# Altium schematic sheet MotorDriverDRV8313_1.SchDoc
size A4
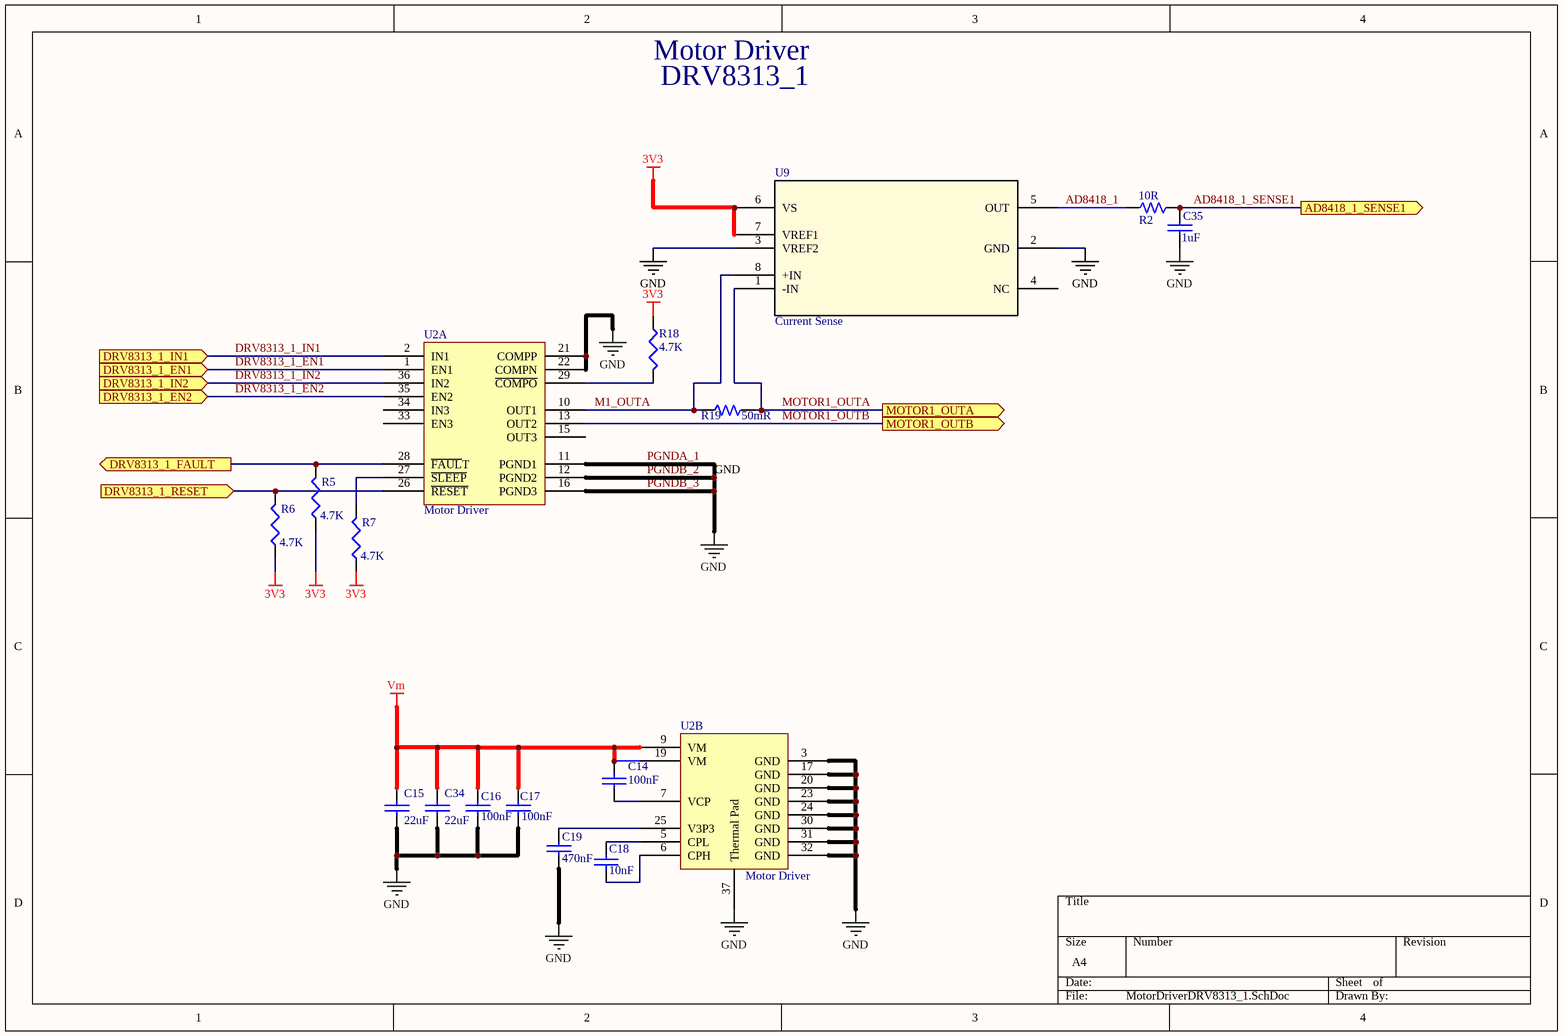
[diagram p0: MotorDriverDRV8313_1.SchDoc]

## Parts
C14  value 100nF  [CAP0402]  (hidden comment: Capacitor)
C15  value 22uF  [CAP0805]  (hidden comment: Capacitor)
C16  value 100nF  [CAP0402]  (hidden comment: Capacitor)
C17  value 100nF  [CAP0402]  (hidden comment: Capacitor)
C18  value 10nF  [CAP0402]  (hidden comment: Capacitor)
C19  value 470nF  [CAP0402]  (hidden comment: Capacitor)
C34  value 22uF  [CAP0805]  (hidden comment: Capacitor)
C35  value 1uF  [CAP0402]  (hidden comment: Capacitor)
R2  Resistance: 10R  [RES0402]  (hidden comment: Resistor)
R5  value 4.7K  [RES0402]  (hidden comment: Res)
R6  value 4.7K  [RES0402]  (hidden comment: Res)
R7  value 4.7K  [RES0402]  (hidden comment: Res)
R18  value 4.7K  [RES0402]  (hidden comment: Res)
R19  Resistance: 50mR  [RES0805]  (hidden comment: Resistor)
U2  Motor Driver  [DRV8313RHHR]  (parts A,B of 2)
U9  Current Sense  [AD8418BRMZ]

## Ports
AD8418_1_SENSE1 (out), DRV8313_1_EN1 (in), DRV8313_1_EN2 (in), DRV8313_1_FAULT (out), DRV8313_1_IN1 (in), DRV8313_1_IN2 (in), DRV8313_1_RESET (in), MOTOR1_OUTA (out), MOTOR1_OUTB (out)

## Nets
3V3: R5.1 R6.1 R7.1 R18.1 U9.6(VS) U9.7(VREF1)
GND: C15.2 C16.2 C17.2 C19.2 C34.2 C35.2 U2.3(GND) U2.11(PGND1) U2.12(PGND2) U2.16(PGND3) U2.17(GND) U2.20(GND) U2.21(COMPP) U2.22(COMPN) U2.23(GND) U2.24(GND) U2.30(GND) U2.31(GND) U2.32(GND) U2.37(Thermal_Pad) U9.2(GND) U9.3(VREF2)  [also labelled PGNDA_1, PGNDB_2, PGNDB_3]
Vm: C14.1 C15.1 C16.1 C17.1 C34.1 U2.9(VM) U2.19(VM)
AD8418_1: R2.1 U9.5(OUT)
AD8418_1_SENSE1: C35.1 R2.2 ; port AD8418_1_SENSE1
DRV8313_1_EN1: U2.1(EN1) ; port DRV8313_1_EN1
DRV8313_1_EN2: U2.35(EN2) ; port DRV8313_1_EN2
DRV8313_1_FAULT: R5.2 U2.28(~{FAUL}T) ; port DRV8313_1_FAULT
DRV8313_1_IN1: U2.2(IN1) ; port DRV8313_1_IN1
DRV8313_1_IN2: U2.36(IN2) ; port DRV8313_1_IN2
DRV8313_1_RESET: R6.2 U2.26(~{RESET}) ; port DRV8313_1_RESET
M1_OUTA: R19.1 U2.10(OUT1) U9.8(+IN)
MOTOR1_OUTA: R19.2 U9.1(-IN) ; port MOTOR1_OUTA
MOTOR1_OUTB: U2.13(OUT2) ; port MOTOR1_OUTB
NetC14_2: C14.2 U2.7(VCP)
NetC18_1: C18.1 U2.5(CPL)
NetC18_2: C18.2 U2.6(CPH)
NetC19_1: C19.1 U2.25(V3P3)
NetR7_2: R7.2 U2.27(~{SLEEP})
NetR18_2: R18.2 U2.29(~{COMPO})

Not connected (* = marked no-connect by the designer): U2 15(OUT3) 33(EN3) 34(IN3); U9 4(NC)

## Notes on the sheet
- Motor Driver
- DRV8313_1

## Library data of the parts
C14 C16 C17 = Capacitor: Manufacturer: TDK Corporation; Manufacturer Part Number: CGA2B3X7R1V104K050BB; Tolerance: 10%; Voltage: 35V; Temperature Coefficient: X7R; Supplier: Digi-Key; Supplier Part Number: 445-6901-1-ND; Footprint: 0201 (0603 Metric); Component Type: Capacitor Ceramic; Price: 0.21
C15 C34 = Capacitor: Manufacturer: TDK Corporation; Manufacturer Part Number: C2012JB1V226M125AC; Tolerance: 20%; Voltage: 35V; Supplier: Digikey; Supplier Part Number: 445-11527-1-ND; Footprint: 0805; Component Type: Capacitor Ceramic; Price: 1.49
C18 = Capacitor: Manufacturer: TDK Corporation; Manufacturer Part Number: C1005X7R1V103K050BB; Tolerance: 10%; Voltage: 35V; Temperature Coefficient: X7R; Supplier: Digi-Key; Supplier Part Number: 445-7338-1-ND; Footprint: 0201 (0603 Metric); Component Type: Capacitor Ceramic; Price: 0.14
C19 = Capacitor: Manufacturer: Murata Electronics North America; Manufacturer Part Number: GRM155R61A474KE15D; Tolerance: 10%; Voltage: 10V; Temperature Coefficient: X5R; Supplier: Digi-Key; Supplier Part Number: 490-3264-1-ND; Footprint: 0201 (0603 Metric); Component Type: Capacitor Ceramic; Price: 0.140
C35 = Capacitor: Manufacturer: TDK Corporation; Manufacturer Part Number: C1005X5R1V105K050BC; Tolerance: 10%; Voltage: 35V; Temperature Coefficient: X5R; Supplier: Digikey; Supplier Part Number: 445-9073-1-ND; Footprint: 0402 (1005 Metric); Component Type: Capacitor Ceramic
R2 = Resistor: Manufacturer 1: Panasonic; Manufacturer Part Number 1: ERJ-2RKF10R0X; Voltage Rating (DC): 50V; Max Power Dissipation: 100mW; Tolerance: 1%; Temperature Coefficient: 100ppm/°C; Supplier 1: Digi-Key; Supplier Part Number 1: P10.0LCT-ND; Stock 1: 6121248; Pricing 1: 1=0,10000, 10=0,04800, 100=0,01960, 1000=0,00882, 2500=0,00766, 5000=0,00633 (USD); RoHS: Yes; Mount: Surface Mount; Case/Package: 0402; Number of Pins: 2; Case Code (Imperial): 0402; Case Code (Metric): 1005; Contact Plating: Tin; Min Operating Temperature: -55°C; Max Operating Temperature: 155°C; Features: Automotive AEC-Q200; Power Rating: 100mW; Termination: SMD/SMT; Composition: Thick Film; Voltage Rating: 50V; Number of Terminations: 2; Packaging: Tape and Reel; Military Standard: Not; Package Quantity: 1; Length: 1mm; Height: 0.35mm; Depth: 0.5mm; Width: 0.5mm; Radiation Hardening: No; Lead Free: Lead Free; REACH SVHC: No SVHC; ComponentLink1URL: https://datasheet.ciiva.com/11821/0900766b80f80784-11821168.pdf?src-supplier=RSComponents; ComponentLink1Description: https://datasheet.ciiva.com/11821/0900766b80f80784-11821168.pdf?src-supplier=RSComponents; ComponentLink2URL: https://datasheet.ciiva.com/7802/aoa0000ce2-7802405.pdf?src-supplier=Element14; ComponentLink2Description: https://datasheet.ciiva.com/7802/aoa0000ce2-7802405.pdf?src-supplier=Element14; ComponentLink3URL: https://datasheet.ciiva.com/43467/1678782-43467127.pdf?src-supplier=Farnell; ComponentLink3Description: https://datasheet.ciiva.com/43467/1678782-43467127.pdf?src-supplier=Farnell; ComponentLink4URL: https://datasheet.ciiva.com/22668/1678782-22668302.pdf?src-supplier=Element14; ComponentLink4Description: https://datasheet.ciiva.com/22668/1678782-22668302.pdf?src-supplier=Element14; ComponentLink5URL: https://datasheet.ciiva.com/16773/70260748-16773366.pdf?src-supplier=Allied+Electronics; ComponentLink5Description: https://datasheet.ciiva.com/16773/70260748-16773366.pdf?src-supplier=Allied+Electronics; ComponentLink6URL: https://datasheet.ciiva.com/9194/aoa0000ce2-9194120.pdf?src-supplier=Avnet; ComponentLink6Description: https://datasheet.ciiva.com/9194/aoa0000ce2-9194120.pdf?src-supplier=Avnet; ComponentLink7URL: https://datasheet.ciiva.com/30218/aoa0000ce2-30218536.pdf?src-supplier=Onlinecomponents.com; ComponentLink7Description: https://datasheet.ciiva.com/30218/aoa0000ce2-30218536.pdf?src-supplier=Onlinecomponents.com; ComponentLink8URL: https://datasheet.ciiva.com/17212/aoa0000ce2-17212057.pdf?src-supplier=Avnet+Europe; ComponentLink8Description: https://datasheet.ciiva.com/17212/aoa0000ce2-17212057.pdf?src-supplier=Avnet+Europe; ComponentLink9URL: https://datasheet.ciiva.com/24071/aoa0000ce2-24071514.pdf?src-supplier=Mouser; ComponentLink9Description: https://datasheet.ciiva.com/24071/aoa0000ce2-24071514.pdf?src-supplier=Mouser; ComponentLink10URL: https://datasheet.ciiva.com/27055/1987054-27055644.pdf?src-supplier=Jameco; ComponentLink10Description: https://datasheet.ciiva.com/27055/1987054-27055644.pdf?src-supplier=Jameco; ComponentLink11URL: https://datasheet.ciiva.com/6082/aoa0000ce2-6082046.pdf?src-supplier=Farnell; ComponentLink11Description: https://datasheet.ciiva.com/6082/aoa0000ce2-6082046.pdf?src-supplier=Farnell
R5-R7 R18 = Resistor: Manufacturer: Yageo; Manufacturer Part Number: RC0402JR-074K7L; Power Rating: 0.063W; Tolerance: 5%; Component Type: Resistor; Price: 0.14; Supplier: Digikey; Supplier Part Number: 311-4.7KJRCT-ND; Footprint: 0402
R19 = Resistor: Manufacturer 1: Bourns; Manufacturer Part Number 1: CRM0805-FW-R050ELF; Power Rating: 250mW; Tolerance: 1%; Voltage Rating: 477mV; Temperature Coefficient: 200ppm/°C; Supplier 1: Digi-Key; Supplier Part Number 1: CRM0805-FW-R050ELFCT-ND; Stock 1: 43412; Pricing 1: 1=0,65000, 10=0,48200, 25=0,39120, 50=0,34020, 100=0,28070, 250=0,24384, 500=0,19846, 1000=0,15741 (USD); RoHS: Yes; Case/Package: 0805; Number of Pins: 2; Case Code (Imperial): 0805; Case Code (Metric): 2012; Min Operating Temperature: -55°C; Max Operating Temperature: 155°C; Composition: Thick Film; Number of Terminations: 2; Packaging: Tape and Reel; Package Quantity: 1; Max Power Dissipation: 250mW; Length: 0.079inch; Height: 0.024inch; Width: 0.047inch; REACH SVHC: No SVHC; ComponentLink1URL: https://datasheet.ciiva.com/22693/1859481-22693285.pdf?src-supplier=Element14; ComponentLink1Description: https://datasheet.ciiva.com/22693/1859481-22693285.pdf?src-supplier=Element14; ComponentLink2URL: https://datasheet.ciiva.com/6564/crm0805-1206-2010-6564006.pdf?src-supplier=Digi-Key; ComponentLink2Description: https://datasheet.ciiva.com/6564/crm0805-1206-2010-6564006.pdf?src-supplier=Digi-Key; ComponentLink3URL: https://datasheet.ciiva.com/6564/crm0805-1206-2010-6564007.pdf?src-supplier=Digi-Key; ComponentLink3Description: https://datasheet.ciiva.com/6564/crm0805-1206-2010-6564007.pdf?src-supplier=Digi-Key; ComponentLink4URL: https://datasheet.ciiva.com/6564/crm0805-1206-2010-6564008.pdf?src-supplier=Digi-Key; ComponentLink4Description: https://datasheet.ciiva.com/6564/crm0805-1206-2010-6564008.pdf?src-supplier=Digi-Key; ComponentLink5URL: https://datasheet.ciiva.com/7985/1859481-7985934.pdf?src-supplier=Element14; ComponentLink5Description: https://datasheet.ciiva.com/7985/1859481-7985934.pdf?src-supplier=Element14
U2 = DRV8313RHHR: 2.5A 3-phase BLDC controller; Manufacturer: Texas Instruments; Component Type: Motor Driver Power MOSFET; Manufacturer Part Number: DRV8313RHHR; Price: 5.08; Supplier: Digi-Key; Supplier Part Number: 296-44591-1-ND
U9 = AD8418BRMZ: Imported; Manufacturer: Analog Devices Inc; Component Type: Current Sense Amplifier 1 Circuit 8-MSOP; Manufacturer Part Number: AD8418BRMZ; Supplier: Digi-Key; Supplier Part Number: AD8418BRMZ-ND; Price: 3.50